# Altium schematic sheet thucthi.SchDoc
size A; SheetNumber: 1; SheetTotal: 1
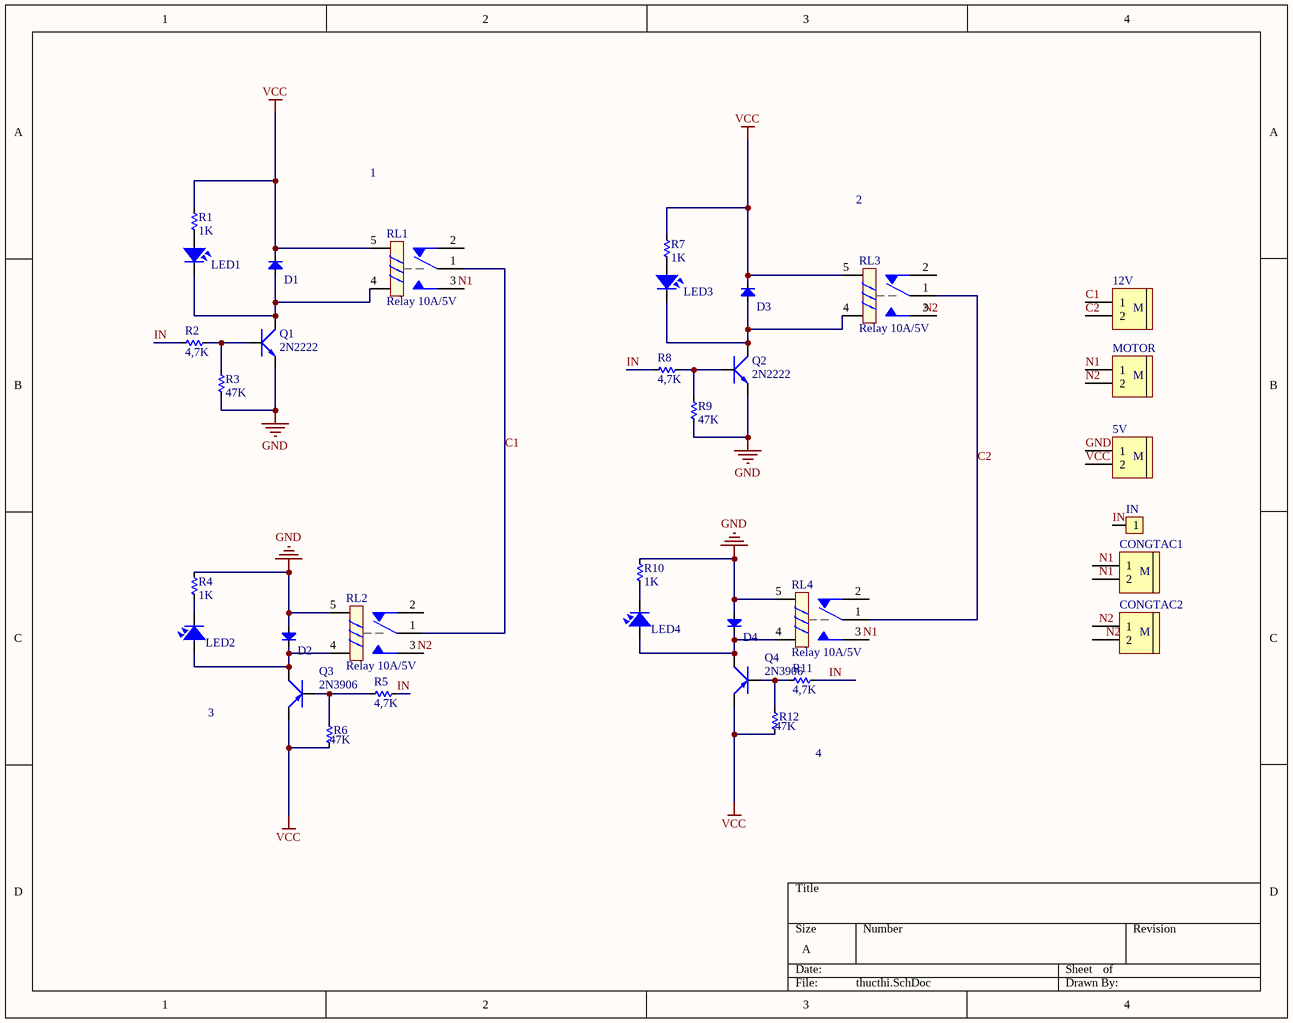
[diagram p0: thucthi.SchDoc]

## Parts
5V  Header 2 - M  [Medium - Header 2]  (value not drawn)
12V  Header 2 - M  [Medium - Header 2]  (value not drawn)
CONGTAC1  Header 2 - M  [Medium - Header 2]  (value not drawn)
CONGTAC2  Header 2 - M  [Medium - Header 2]  (value not drawn)
D1  Diode  [DIO-1A]  (value not drawn)
D2  Diode  [DIO-1A]  (value not drawn)
D3  Diode  [DIO-1A]  (value not drawn)
D4  Diode  [DIO-1A]  (value not drawn)
IN  JP1  [JP1-D1T]  (value not drawn)
LED1  LED  [LED-5-RED]  (value not drawn)
LED2  LED  [LED-5-Green]  (value not drawn)
LED3  LED  [LED-5-RED]  (value not drawn)
LED4  LED  [LED-5-Green]  (value not drawn)
MOTOR  Header 2 - M  [Medium - Header 2]  (value not drawn)
Q1  2N2222  [TO92-123]
Q2  2N2222  [TO92-123]
Q3  2N3906  [TO92-123]
Q4  2N3906  [TO92-123]
R1  1K  [RES-1/2W]
R2  4,7K  [RES-1/2W]
R3  47K  [RES-1/2W]
R4  1K  [RES-1/2W]
R5  4,7K  [RES-1/2W]
R6  47K  [RES-1/2W]
R7  1K  [RES-1/2W]
R8  4,7K  [RES-1/2W]
R9  47K  [RES-1/2W]
R10  1K  [RES-1/2W]
R11  4,7K  [RES-1/2W]
R12  47K  [RES-1/2W]
RL1  Relay 10A/5V  [RELAY 5]
RL2  Relay 10A/5V  [RELAY 5]
RL3  Relay 10A/5V  [RELAY 5]
RL4  Relay 10A/5V  [RELAY 5]

## Nets
GND: 5V.1 D2.1(A) D4.1(A) Q1.1(E) Q2.1(E) R3.1 R4.2 R9.1 R10.2 RL2.5 RL4.5
VCC: 5V.2 D1.2(K) D3.2(K) Q3.1(E) Q4.1(E) R1.2 R6.1 R7.2 R12.1 RL1.5 RL3.5
C1: 12V.1 RL1.1 RL2.1
C2: 12V.2 RL3.1 RL4.1
IN: IN.1 R2.2 R5.2 R8.2 R11.2
N1: MOTOR.1
N2: MOTOR.2
NetD1_1: D1.1(A) LED1.2 Q1.3(C) RL1.4
NetD2_2: D2.2(K) LED2.1 Q3.3(C) RL2.4
NetD3_1: D3.1(A) LED3.2 Q2.3(C) RL3.4
NetD4_2: D4.2(K) LED4.1 Q4.3(C) RL4.4
NetLED1_1: LED1.1 R1.1
NetLED2_2: LED2.2 R4.1
NetLED3_1: LED3.1 R7.1
NetLED4_2: LED4.2 R10.1
NetQ1_2: Q1.2(B) R2.1 R3.2
NetQ2_2: Q2.2(B) R8.1 R9.2
NetQ3_2: Q3.2(B) R5.1 R6.2
NetQ4_2: Q4.2(B) R11.1 R12.2

Not connected (* = marked no-connect by the designer): CONGTAC1 1 2; CONGTAC2 1 2; RL1 2 3; RL2 2 3; RL3 2 3; RL4 2 3

## Notes on the sheet
- 1
- 2
- 3
- 4
- Labels drawn without touching a wire or pin: N1, N2
- (in symbol Header 2 - M) M

## Library data of the parts
5V 12V CONGTAC1 CONGTAC2 MOTOR = Header 2 - M: Header, 2-Pin, Medium; LatestRevisionDate: 17-Jul-2002; LatestRevisionNote: Re-released for DXP Platform.; Publisher: Altium Limited
D1-D4 = Diode: Default Diode; Code - JEDEC: DO-214-AB; Value: 1N5007; Published: 8-Jun-2000; Revision: July-2002: Re-released for DXP Platform.; Publisher: Altium Limited
IN = JP1: WR-PHD 2.54 mm Angled Socket Header; Manufacturer: W¨¹rth Elektronik eiSos GmbH; partNo: 613002143121; ComponentLink1 Description: Manufacturer; ComponentLink2 Description: Datasheet; NoPins: 02; Created Date: 29 March 2013; ComponentLink1URL: http://www.we-online.com; ComponentLink2URL: http://katalog.we-online.de/em/datasheet/6130xx143121.pdf; Created by: Karrer Zheng
LED1-LED4 = LED: LED Single colour Green and Red; Value: LED 3 ly Single Colour
Q1 Q2 = 2N222: NPN 600mW, ECB; Value: C1815
Q3 Q4 = 2N3906: PNP 600mW, ECB; Value: A1015
R1-R12 = Res: Manufacturer: Generic Components; Class: Passive; SubClass: R; Published: 08/06/2000; Publisher: Altium Hobart Technology Centre
RL1-RL4 = Relay 5: Relay SPDT,10A - 12VDC 5 Pin; Value: Relay SPDT, 10A, 12V